# EAGLE schematic Full-Pi-Wiringsch (EAGLE 9.2.0)
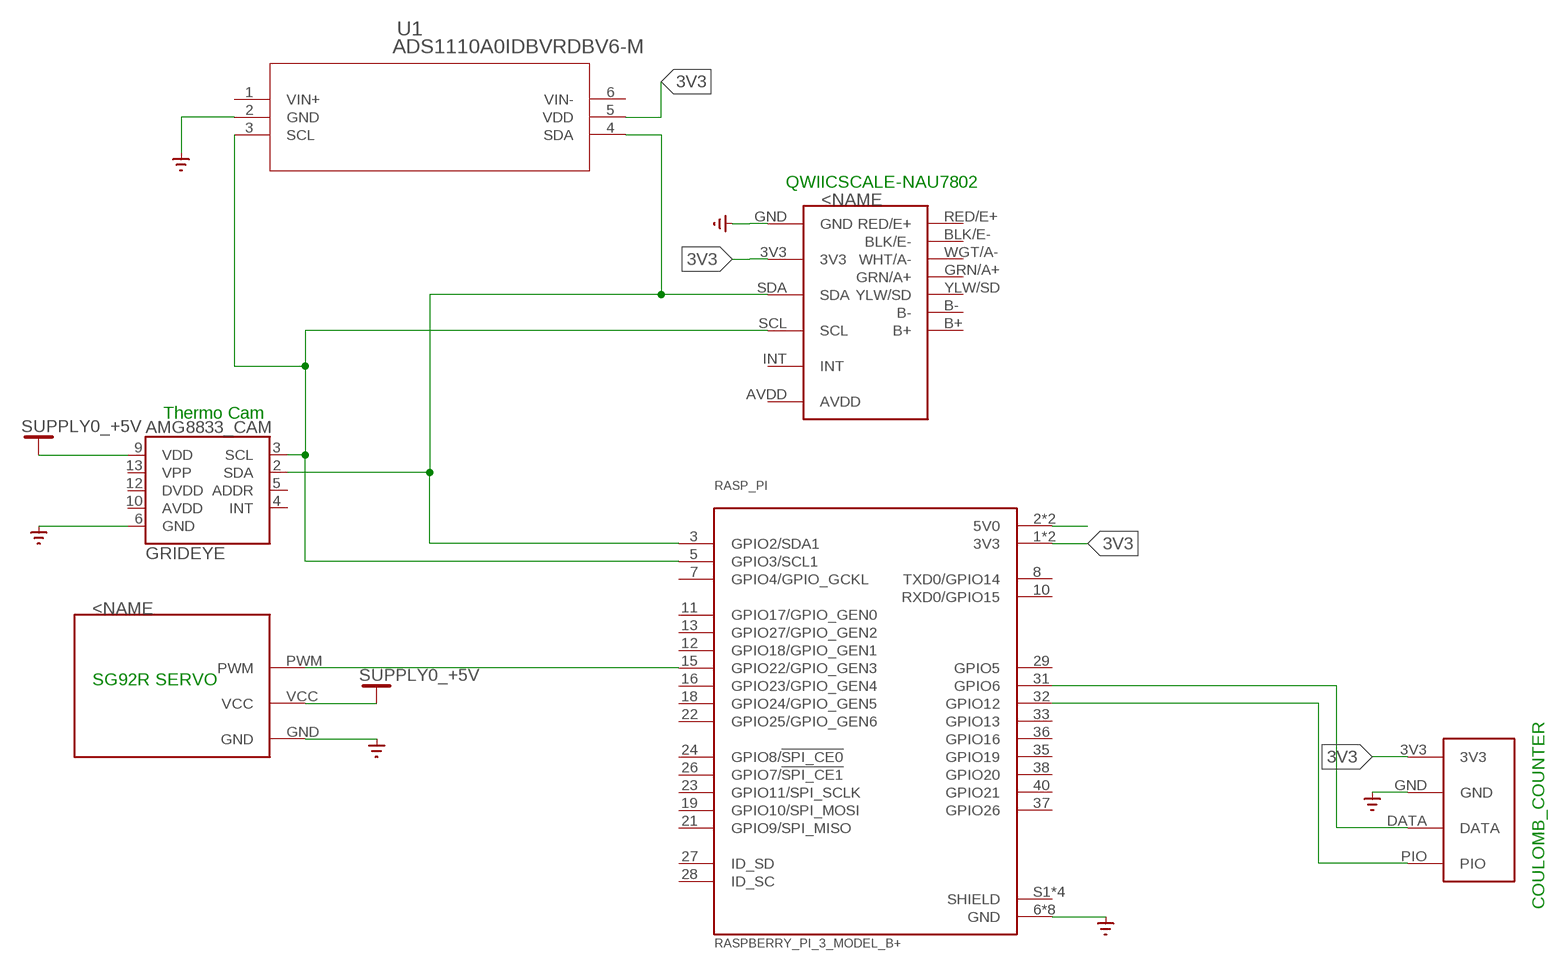
[diagram p0: schematic, sheet 1]

## Parts
AMG8833_CAM  GRIDEYE  [GRIDEYE-AMG88]
COULOMB_COUNTER1  COULOMB_COUNTER  [COULOMB_COUNTER]
QWIICSCALE1  QWIICSCALE-NAU7802-SPARK-FUN  [QWIICSCALE-NAU7802-SPARK-FUN]
RASP_PI  RASPBERRY_PI_3_MODEL_B+  [MODULE_RASPBERRY_PI_3_MODEL_B+]
SG92R_SERVO1  SG92R_MICRO_SERVO  [SG92R_MICRO_SERVO]
U1  ADS1110A0IDBVRDBV6-M  [DBV6-M]

## Nets
3V3: COULOMB_COUNTER1.3V3 QWIICSCALE1.3V3 RASP_PI.1(3V3) RASP_PI.17(3V3) U1.5(VDD)
+5V: AMG8833_CAM.9(VDD) SG92R_SERVO1.VCC ; supply symbol labelled SUPPLY0_+5V
GND: AMG8833_CAM.6(GND) COULOMB_COUNTER1.GND QWIICSCALE1.GND RASP_PI.6(GND) RASP_PI.9(GND) RASP_PI.14(GND) RASP_PI.20(GND) RASP_PI.25(GND) RASP_PI.30(GND) RASP_PI.34(GND) RASP_PI.39(GND) SG92R_SERVO1.GND U1.2(GND) ; supply symbol labelled SUPPLY0_GND_
N$1: AMG8833_CAM.2(SDA) QWIICSCALE1.SDA RASP_PI.3(GPIO2/SDA1) U1.4(SDA)
N$2: AMG8833_CAM.3(SCL) QWIICSCALE1.SCL RASP_PI.5(GPIO3/SCL1) U1.3(SCL)
N$3: RASP_PI.15(GPIO22/GPIO_GEN3) SG92R_SERVO1.PWM
N$5: COULOMB_COUNTER1.DATA RASP_PI.31(GPIO6)
N$7: RASP_PI.2(5V0) RASP_PI.4(5V0)
N$8: COULOMB_COUNTER1.PIO RASP_PI.32(GPIO12)
Unconnected: AMG8833_CAM.4(INT) AMG8833_CAM.5(ADDR) AMG8833_CAM.10(AVDD) AMG8833_CAM.12(DVDD) AMG8833_CAM.13(VPP) QWIICSCALE1.AVDD QWIICSCALE1.B+ QWIICSCALE1.B- QWIICSCALE1.BLK/E- QWIICSCALE1.GRN/A+ QWIICSCALE1.INT QWIICSCALE1.RED/E+ QWIICSCALE1.WGT/A-(WHT/A-) QWIICSCALE1.YLW/SD RASP_PI.7(GPIO4/GPIO_GCKL) RASP_PI.8(TXD0/GPIO14) RASP_PI.10(RXD0/GPIO15) RASP_PI.11(GPIO17/GPIO_GEN0) RASP_PI.12(GPIO18/GPIO_GEN1) RASP_PI.13(GPIO27/GPIO_GEN2) RASP_PI.16(GPIO23/GPIO_GEN4) RASP_PI.18(GPIO24/GPIO_GEN5) RASP_PI.19(GPIO10/SPI_MOSI) RASP_PI.21(GPIO9/SPI_MISO) RASP_PI.22(GPIO25/GPIO_GEN6) RASP_PI.23(GPIO11/SPI_SCLK) RASP_PI.24(GPIO8/!SPI_CE0!) RASP_PI.26(GPIO7/!SPI_CE1!) RASP_PI.27(ID_SD) RASP_PI.28(ID_SC) RASP_PI.29(GPIO5) RASP_PI.33(GPIO13) RASP_PI.35(GPIO19) RASP_PI.36(GPIO16) RASP_PI.37(GPIO26) RASP_PI.38(GPIO20) RASP_PI.40(GPIO21) U1.1(VIN+) U1.6(VIN-)

## Notes on the sheet
- QWIICSCALE-NAU7802
- Thermo Cam
- SG92R SERVO
- COULOMB_COUNTER

## Power pins joined to a net without a drawn wire
SHIELD: RASP_PI.S1(SHIELD) RASP_PI.S2(SHIELD) RASP_PI.S3(SHIELD) RASP_PI.S4(SHIELD)

## Library data of the parts
AMG8833_CAM = SparkFun-Sensors:GRIDEYE: Panasonic AMG8833 GRIDEye This 8x8 thermopile infrared sensor array allows for a low resolution thermal camera.; PROD_ID: IC-13912
COULOMB_COUNTER1 = Customs:COULOMB_COUNTER
QWIICSCALE1 = Customs:QWIICSCALE-NAU7802-SPARK-FUN
RASP_PI = RASPBERRY_PI_3_MODEL_B_:RASPBERRY_PI_3_MODEL_B+: BCM2835 Raspberry Pi Model B+ - ARM11, VideoCore MPU Embedded Evaluation Board Check prices <https://pricing.snapeda.com/parts/RASPBERRY%20PI%203%20MODEL%20B%2B/Raspberry%20Pi/view-part?ref=eda>; AVAILABILITY: Warning; DESCRIPTION: RASPBERRY PI 3 MOD B+ BCM2837B0; MF: Raspberry Pi; MP: RASPBERRY PI 3 MODEL B+; PACKAGE: Raspberry Pi; PRICE: None; PURCHASE-URL: https://pricing.snapeda.com/search/part/RASPBERRY PI 3 MODEL B+/?ref=eda
SG92R_SERVO1 = Customs:SG92R_MICRO_SERVO
U1 = ADS1110:ADS1110A0IDBVR; DATASHEET_URL: http://www.ti.com/lit/gpn/ADS1110; DESCRIPTION: 16-Bit Delta-Sigma ADC with internal reference, PGA and oscillator. I2C Serial Interface; FAMILY_NAME: PRECISION ADC (<=10MSPS); GENERIC_PART_NUMBER: ADS1110; INDUSTRY_STD_PKG_TYPE: SOT-23; MANUFACTURER: Texas Instruments; PACKAGE_DESIGNATOR: DBV; PIN_COUNT: 6